# Altium schematic sheet 1.USB_Power_Delivery.SchDoc
size B; ApprovedBy: Shijith Mohan; Author: Krishnawa; SheetNumber: 2; SheetTotal: 13
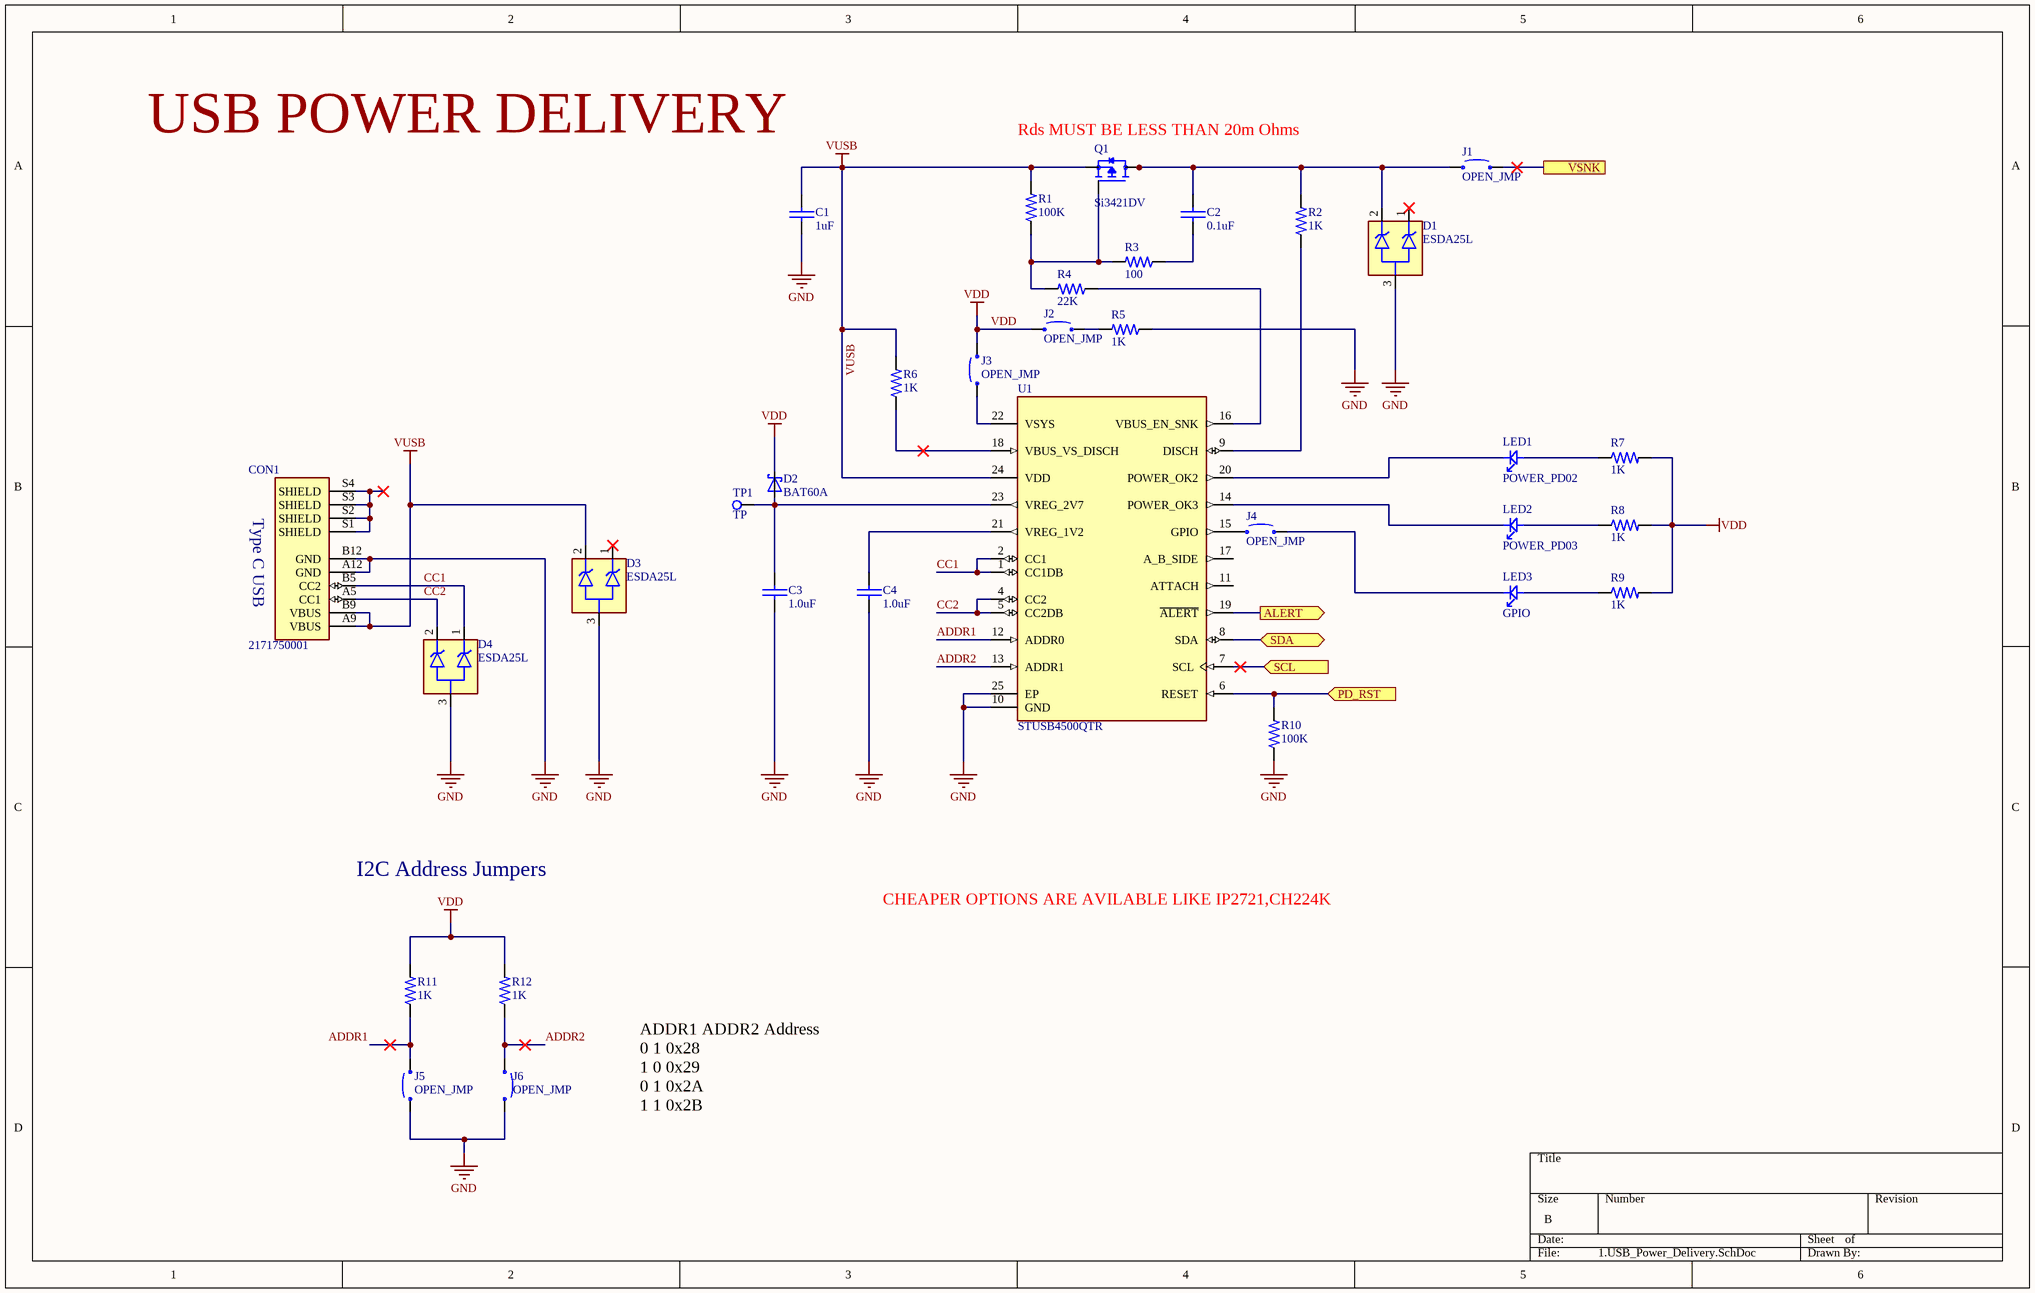
[diagram p0: 1.USB_Power_Delivery.SchDoc]

## Parts
C1  1uF  [C_0603]
C2  0.1uF  [C_0603]
C3  1.0uF  [C_0603]
C4  1.0uF  [C_0603]
CON1  2171750001  [217175-0001]
D1  ESDA25L  [SOT-23-3]
D2  BAT60A  [SOD-323]
D3  ESDA25L  [SOT-23-3]
D4  ESDA25L  [SOT-23-3]
J1  OPEN_JMP  [OPEN_JMP]
J2  OPEN_JMP  [OPEN_JMP]
J3  OPEN_JMP  [OPEN_JMP]
J4  OPEN_JMP  [OPEN_JMP]
J5  OPEN_JMP  [OPEN_JMP]
J6  OPEN_JMP  [OPEN_JMP]
LED1  POWER_PD02  [LED_0603]
LED2  POWER_PD03  [LED_0603]
LED3  GPIO  [LED_0603]
Q1  Si3421DV  [TSOP-6]
R1  100K  [R_0603]
R2  1K  [R_0603]
R3  100  [R_0603]
R4  22K  [R_0603]
R5  1K  [R_0603]
R6  1K  [R_0603]
R7  1K  [R_0603]
R8  1K  [R_0603]
R9  1K  [R_0603]
R10  100K  [R_0603]
R11  1K  [R_0603]
R12  1K  [R_0603]
TP1  TP  [TP]
U1  STUSB4500QTR  [VFQFN-24]

## Ports
ALERT (out), PD_RST (in), SCL (in), SDA (bidir), VSNK

## Nets
GND: C1.1 C3.1 C4.1 CON1.A12(GND) CON1.B12(GND) D1.3(CA) D3.3(CA) D4.3(CA) J5.1 J6.1 R5.1 R10.1 U1.10(GND) U1.25(EP)
VDD: D2.C J2.1 J3.2 R7.2 R8.2 R9.2 R11.2 R12.2
VUSB: C1.2 CON1.A9(VBUS) CON1.B9(VBUS) D3.2(C2) Q1.4(S) R1.2 R6.2 U1.24(VDD)
ADDR1: J5.2 R11.1 U1.12(ADDR0)
ADDR2: J6.2 R12.1 U1.13(ADDR1)
ALERT: U1.19(~{ALERT}) ; port ALERT
CC1: CON1.B5(CC2) D4.1(C1) U1.1(CC1DB) U1.2(CC1)
CC2: CON1.A5(CC1) D4.2(C2) U1.4(CC2) U1.5(CC2DB)
PD_RST: R10.2 U1.6(RESET) ; port PD_RST
SCL: U1.7(SCL) ; port SCL
SDA: U1.8(SDA) ; port SDA
VSNK: J1.2 ; port VSNK
NetC2_1: C2.1 R3.1
NetC2_2: C2.2 D1.2(C2) J1.1 Q1.1(D) Q1.2(D) Q1.5(D) Q1.6(D) R2.2
NetC3_2: C3.2 D2.A TP1.1 U1.23(VREG_2V7)
NetC4_2: C4.2 U1.21(VREG_1V2)
NetCON1_S1: CON1.S1(SHIELD) CON1.S2(SHIELD) CON1.S3(SHIELD) CON1.S4(SHIELD)
NetJ2_2: J2.2 R5.2
NetJ3_1: J3.1 U1.22(VSYS)
NetJ4_1: J4.1 U1.15(GPIO)
NetJ4_2: J4.2 LED3.K
NetLED1_A: LED1.A R7.1
NetLED1_K: LED1.K U1.20(POWER_OK2)
NetLED2_A: LED2.A R8.1
NetLED2_K: LED2.K U1.14(POWER_OK3)
NetLED3_A: LED3.A R9.1
NetQ1_3: Q1.3(G) R1.1 R3.2 R4.2
NetR2_1: R2.1 U1.9(DISCH)
NetR4_1: R4.1 U1.16(VBUS_EN_SNK)
NetR6_1: R6.1 U1.18(VBUS_VS_DISCH)

Not connected (* = marked no-connect by the designer): D1 1(C1)*; D3 1(C1)*; U1 11(ATTACH) 17(A_B_SIDE)

## Notes on the sheet
- USB POWER DELIVERY
- (near Q1) Rds MUST BE LESS THAN 20m Ohms
- I2C Address Jumpers
- CHEAPER OPTIONS ARE AVILABLE LIKE IP2721,CH224K
- ADDR1	ADDR2	Address
  0	1	0x28
  1	0	0x29
  0	1	0x2A
  1	1	0x2B
- (in symbol 2171750001) Type C USB

## Library data of the parts
C1-C4 = C_0603: D: *; MFR: *; P: *; PN: *; URL: *
CON1 = 2171750001: MFR: Molex; D: USB Connectors Top-Mnt SMT 6Ckt Type C Rec.; P: 6 Contact; PN: 217175-0001; URL: https://www.mouser.in/ProductDetail/Molex/217175-0001?qs=DRkmTr78QARWJMiqNnldSg%3D%3D
D1 D3 D4 = ESDA25L: MFR: STMicroelectronics; D: ESD Suppressors / TVS Diodes SUPPRESSOR; P: SOT23-3L; PN: ESDA25L; URL: https://www.mouser.in/ProductDetail/STMicroelectronics/ESDA25L?qs=%252BFmDY%2FmH7IYTgvQLXlr24g%3D%3D
D2 = BAT60A: PN: BAT60AE6327HTSA1; D: Schottky Diodes & Rectifiers 10 V 3000 mA; P: SOD-323; URL: https://www.mouser.in/ProductDetail/Infineon-Technologies/BAT60AE6327HTSA1?qs=OwbwYO03UsIW3Y2lCXbs8Q%3D%3D
LED1-LED3 = LED_0603: MFR: Wurth Elektronik; PN: 150060RS75000; D: Standard LEDs - SMD WL-SMCW SMDMono TpVw Waterclr 0603 Red; P: 0603; YRL: https://www.mouser.in/ProductDetail/Wurth-Elektronik/150060RS75000?qs=LlUlMxKIyB3QnmZ3fw%2FVCA%3D%3D
Q1 = Si3421DV: MFR: Vishay Siliconix; D: P-Channel 30 V (D-S) MOSFET; PN: SI3421DV-T1-GE3; P: TSOP-6; URL: https://www.mouser.in/ProductDetail/Vishay-Semiconductors/SI3421DV-T1-GE3?qs=dpt6vIvaxwjvmZPXyyVpRg%3D%3D
R1-R12 = R_0603: D: *; MFR: *; P: *; PN: *; URL: *
U1 = STUSB4500QTR: MFR: STMicroelectronics; D: USB Interface IC Standalone USB PD controller for power sinking devices; P: QFN-24; PN: STUSB4500QTR; URL: https://www.mouser.in/ProductDetail/STMicroelectronics/STUSB4500QTR?qs=wUXugUrL1qyQbYMSzG1ujg%3D%3D&gclid=CjwKCAiA7IGcBhA8EiwAFfUDsZkZhe45H6sb259SlrXLDhHuC3iFilUbHdwuboXJa3yG6M-NUEA8VhoC06YQAvD_BwE